# EAGLE design PCA9532 (EAGLE 7.5.0)
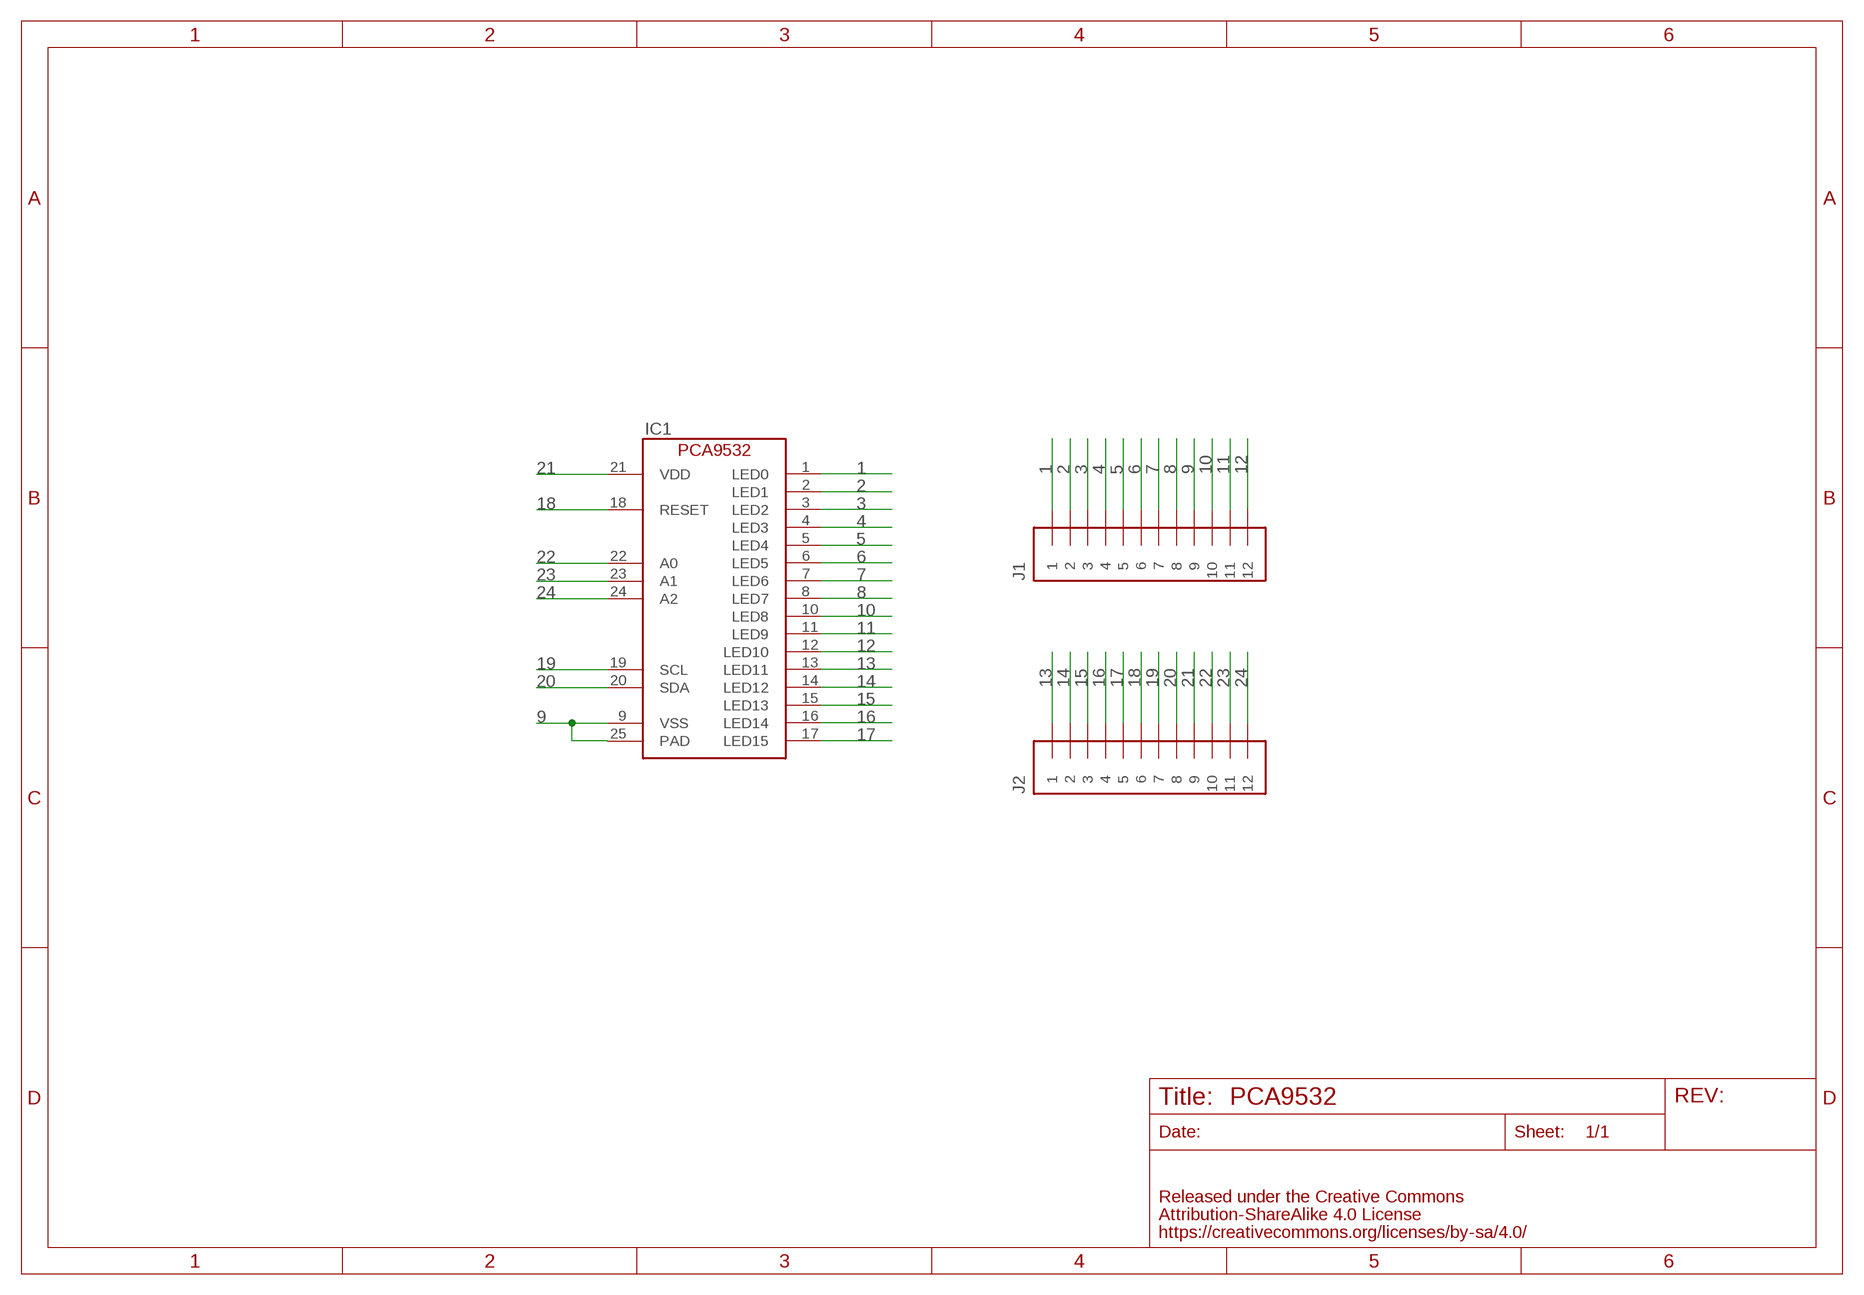
[diagram p0: schematic, sheet 1]

## Parts
IC1  PCA9532BS  [HVQFN24]
J1  PIN_HEADER_1X12  [PIN_1X12_SNEAKY]
J2  PIN_HEADER_1X12  [PIN_1X12_SNEAKY]

## Nets
1: IC1.1(LED0) J1.1
2: IC1.2(LED1) J1.2
3: IC1.3(LED2) J1.3
4: IC1.4(LED3) J1.4
5: IC1.5(LED4) J1.5
6: IC1.6(LED5) J1.6
7: IC1.7(LED6) J1.7
8: IC1.8(LED7) J1.8
9: IC1.9(VSS) IC1.25(PAD) J1.9
10: IC1.10(LED8) J1.10
11: IC1.11(LED9) J1.11
12: IC1.12(LED10) J1.12
13: IC1.13(LED11) J2.1
14: IC1.14(LED12) J2.2
15: IC1.15(LED13) J2.3
16: IC1.16(LED14) J2.4
17: IC1.17(LED15) J2.5
18: IC1.18(RESET) J2.6
19: IC1.19(SCL) J2.7
20: IC1.20(SDA) J2.8
21: IC1.21(VDD) J2.9
22: IC1.22(A0) J2.10
23: IC1.23(A1) J2.11
24: IC1.24(A2) J2.12

## Library data of the parts
IC1 = FaBo-LED:PCA9532
J1 J2 = FaBo-PIN:PIN_HEADER_1X12

## Board
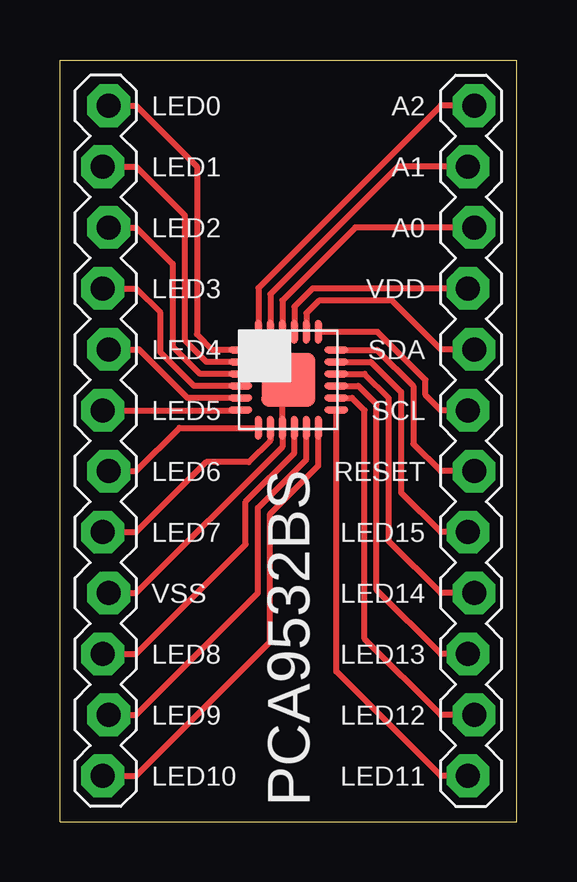
[diagram p1: board, top side]

Size 19.05 x 31.75 mm. Coordinates in mm from the lower left corner, seen from the top.
Outline: 0,0 19.05,0 19.05,31.75 0,31.75 0,0
Copper layers (1*16): Top 0.035mm / dielectric 1.5mm / Bottom 0.035mm
Design rules "Elecrow_2-layer_eagle_rule": minimum track width 6mil, minimum drill 12mil, track to track 6mil, track to pad 6mil, pad to pad 6mil, via to via 6mil, smd to smd 0mil, copper to edge 10mil, drill to drill 10mil, minimum pad ring 10mil, minimum via ring 6mil, stop-mask expansion 2mil, vias tented up to drill 100mil, thermal gap 10mil

### Footprints (pad centres in the part's own frame; a part is rotated, then mirrored left to right if it is on the bottom)
HVQFN24 = smd 1 x 0.3: 1 -2,1.25; 2 -2,0.75; 3 -2,0.25; 4 -2,-0.25; 5 -2,-0.75; 6 -2,-1.25; 13 2,-1.25; 14 2,-0.75; 15 2,-0.25; 16 2,0.25; 17 2,0.75; 18 2,1.25 | smd 0.3 x 1: 7 -1.25,-2; 8 -0.75,-2; 9 -0.25,-2; 10 0.25,-2; 11 0.75,-2; 12 1.25,-2; 19 1.25,2; 20 0.75,2; 21 0.25,2; 22 -0.25,2; 23 -0.75,2; 24 -1.25,2 | smd 2.25 x 2.25: 25 0,0
PIN_1X12_SNEAKY = drill 1 pad 1.778 octagon: 1 -13.97,0.127; 2 -11.43,-0.127; 3 -8.89,0.127; 4 -6.35,-0.127; 5 -3.81,0.127; 6 -1.27,-0.127; 7 1.27,0.127; 8 3.81,-0.127; 9 6.35,0.127; 10 8.89,-0.127; 11 11.43,0.127; 12 13.97,-0.127

### Placement (x,y rotation side)
IC1  9.53,18.41 0 top
J1  1.91,15.88 270 top
J2  17.14,15.88 90 top

### Tracks (layer width: path | path; a pad name or v marks a point on that pad's centre or on a via)
1
  Top 0.254: IC1.1 6.37,19.66 5.71,20.32 5.71,27.3 3.17,29.84 J1.1
2
  Top 0.254: IC1.2 6.11,19.16 5.21,20.07 5.21,25.27 3.17,27.3 J1.2
3
  Top 0.254: J1.3 3.17,24.77 4.7,23.24 4.7,19.81 5.85,18.66 IC1.3
4
  Top 0.254: IC1.4 5.58,18.16 4.19,19.56 4.19,21.21 3.17,22.23 J1.4
5
  Top 0.254: IC1.5 5.32,17.66 3.3,19.68 J1.5
6
  Top 0.254: J1.6 7.5,17.14 IC1.6
7
  Top 0.254: J1.7 3.17,14.61 4.99,16.41 IC1.7
8
  Top 0.254: J1.8 3.17,12.06 6.1,14.99 7.87,14.99 8.78,15.89 IC1.8
9
  Top 0.254: J1.9 3.17,9.53 9.28,15.62 IC1.9 9.28,18.16 IC1.25
10
  Top 0.254: J1.10 3.17,6.99 7.75,11.56 7.75,13.34 9.78,15.37 IC1.10
11
  Top 0.254: J1.11 3.17,4.45 8.26,9.53 8.26,13.08 10.28,15.1 IC1.11
12
  Top 0.254: J1.12 3.17,1.91 8.76,7.49 8.76,12.83 10.78,14.84 IC1.12
13
  Top 0.254: J2.1 15.88,1.91 11.53,6.25 IC1.13
14
  Top 0.254: J2.2 15.88,4.45 12.7,7.62 12.7,17.14 12.18,17.66 IC1.14
15
  Top 0.254: J2.3 15.88,6.99 13.21,9.65 13.21,17.4 12.44,18.16 IC1.15
16
  Top 0.254: J2.4 15.88,9.53 13.72,11.68 13.72,17.65 12.7,18.66 IC1.16
17
  Top 0.254: J2.5 15.88,12.06 14.22,13.72 14.22,17.91 12.97,19.16 IC1.17
18
  Top 0.254: J2.6 15.88,14.61 14.73,15.75 14.73,18.16 13.23,19.66 IC1.18
19
  Top 0.254: J2.7 15.88,17.14 15.24,17.78 15.24,18.41 13.24,20.41 IC1.19
20
  Top 0.254: J2.8 15.88,19.68 13.84,21.72 10.79,21.72 10.28,21.2 IC1.20
21
  Top 0.254: J2.9 10.54,22.23 9.78,21.46 IC1.21
22
  Top 0.254: J2.10 12.32,24.77 9.28,21.72 IC1.22
23
  Top 0.254: J2.11 14.1,27.3 8.78,21.98 IC1.23
24
  Top 0.254: J2.12 15.88,29.84 8.28,22.25 IC1.24

### Text on the board
tPlace: LED0 | A2 | LED1 | A1 | LED2 | A0 | LED3 | VDD | LED4 | SDA | LED5 | SCL | LED6 | RESET | LED7 | LED15 | VSS | LED14 | LED8 | LED13 | LED9 | LED12 | LED10 | LED11 | PCA9532BS